# Altium schematic sheet OvertheTOP.SchDoc: OvertheTOP Sensor Board
size Tabloid; CompanyName: afasfe; Organization: Electric Ray Engineering; Address1: asdf; Address2: http://torpediniformes.com/; Address3: asdf; Address4: asdf; Revision: A1
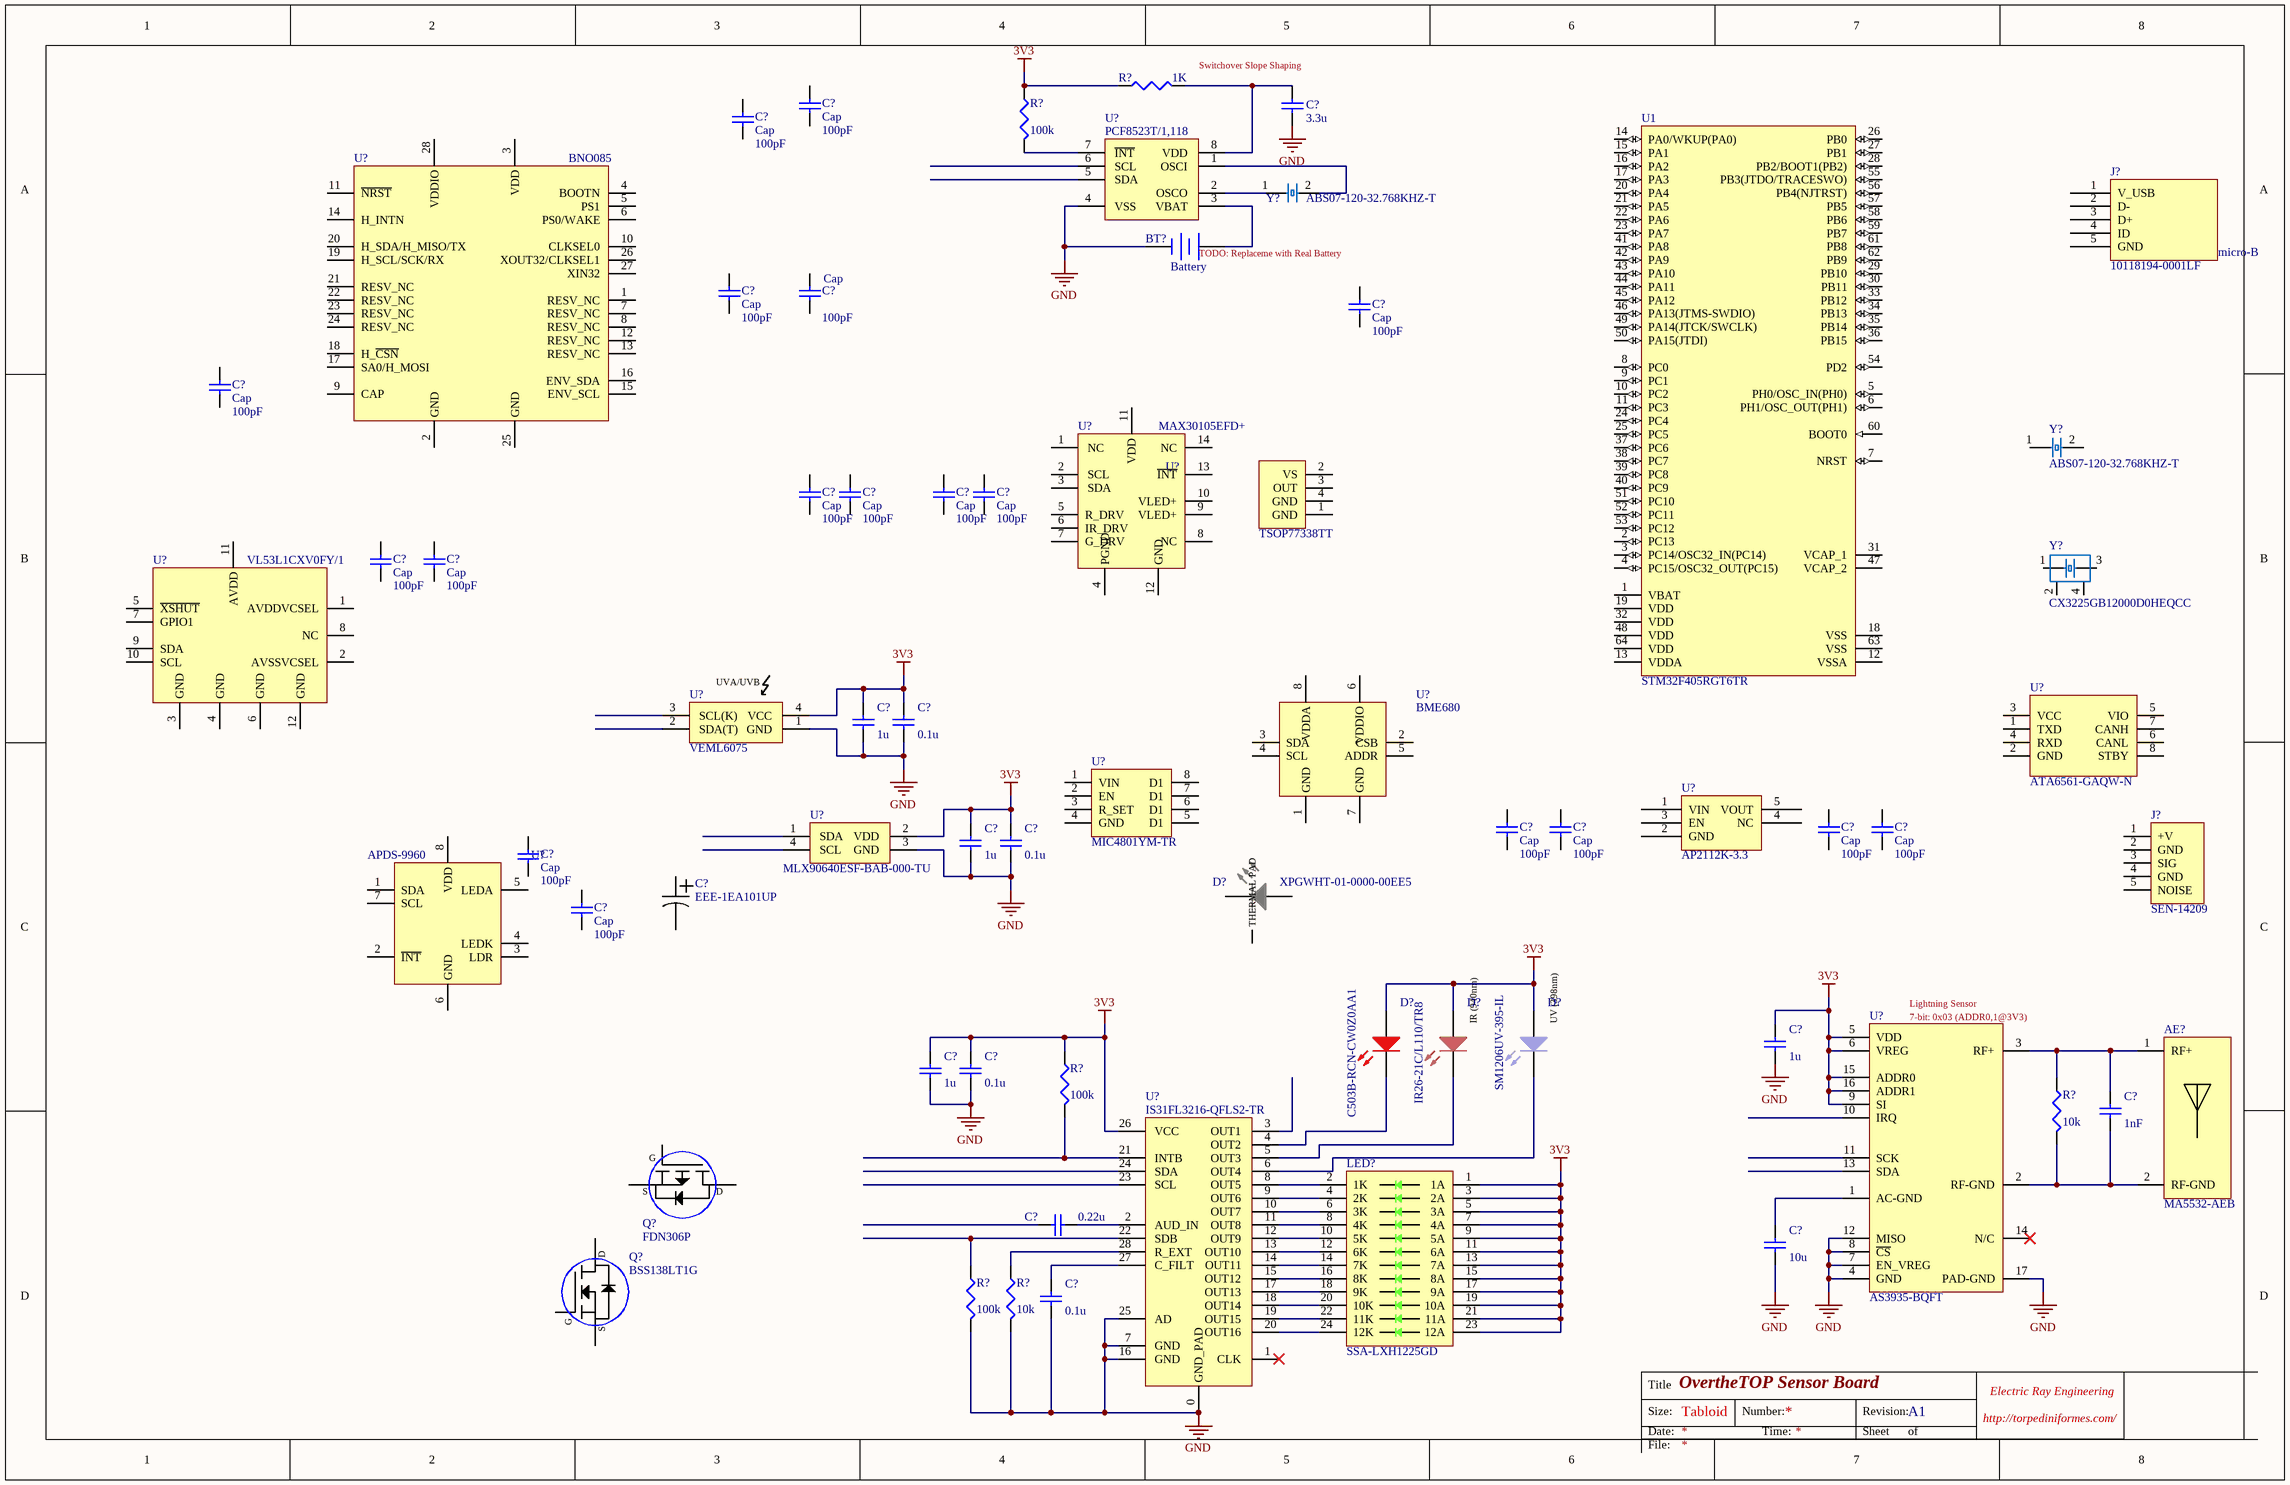
[diagram p0: OvertheTOP.SchDoc]

## Parts
(Parts that share a designator on the sheet are numbered #1, #2 ... from top to bottom, then left to right.)
AE?  MA5532-AEB  [MA5532]
BT?  Battery  [BAT-2]
C?#1  Cap  value 100pF  [6-0805_L]
C?#2  Cap  value 100pF  [6-0805_L]
C?#3  value 3.3u  [6-0805_L]  (hidden comment: Cap)
C?#4  Cap  value 100pF  [6-0805_L]
C?#5  Cap  value 100pF  [6-0805_L]
C?#6  Cap  value 100pF  [6-0805_L]
C?#7  Cap  value 100pF  [6-0805_L]
C?#8  Cap  value 100pF  [6-0805_L]
C?#9  Cap  value 100pF  [6-0805_L]
C?#10  Cap  value 100pF  [6-0805_L]
C?#11  Cap  value 100pF  [6-0805_L]
C?#12  Cap  value 100pF  [6-0805_L]
C?#13  Cap  value 100pF  [6-0805_L]
C?#14  value 1u  [6-0805_L]  (hidden comment: Cap)
C?#15  value 0.1u  [6-0805_L]  (hidden comment: Cap)
C?#16  Cap  value 100pF  [6-0805_L]
C?#17  Cap  value 100pF  [6-0805_L]
C?#18  Cap  value 100pF  [6-0805_L]
C?#19  Cap  value 100pF  [6-0805_L]
C?#20  value 1u  [6-0805_L]  (hidden comment: Cap)
C?#21  value 0.1u  [6-0805_L]  (hidden comment: Cap)
C?#22  Cap  value 100pF  [6-0805_L]
C?#23  EEE-1EA101UP  [CAP_SIZE_E_PANA]
C?#24  Cap  value 100pF  [6-0805_L]
C?#25  value 1u  [6-0805_L]  (hidden comment: Cap)
C?#26  value 1u  [6-0805_L]  (hidden comment: Cap)
C?#27  value 0.1u  [6-0805_L]  (hidden comment: Cap)
C?#28  value 1nF  [0603]  (hidden comment: Cap)
C?#29  value 0.22u  [6-0805_L]  (hidden comment: Cap)
C?#30  value 10u  [6-0805_L]  (hidden comment: Cap)
C?#31  value 0.1u  [6-0805_L]  (hidden comment: Cap)
D?#1  XPGWHT-01-0000-00EE5  [XP-G_LED]
D?#2  C503B-RCN-CW0Z0AA1  [C503B-RCN]
D?#3  IR26-21C/L110/TR8  [IR26-21C/L110/TR8]
D?#4  SM1206UV-395-IL  [SM1206UV-395-IL]
J?#1  10118194-0001LF  [USB-R/A-10118194-0001LF]
J?#2  SEN-14209  [SEN-14209]
LED?  SSA-LXH1225GD  [SSA-LXH1226GD]
Q?#1  FDN306P  [SuperSOT-3]
Q?#2  BSS138LT1G  [SOT-23]
R?#1  value 1K  [J1-0603]  (hidden comment: Res3)
R?#2  value 100k  [J1-0603]  (hidden comment: Res3)
R?#3  value 100k  [J1-0603]  (hidden comment: Res3)
R?#4  value 10k  [J1-0603]  (hidden comment: Res3)
R?#5  value 100k  [J1-0603]  (hidden comment: Res3)
R?#6  value 10k  [J1-0603]  (hidden comment: Res3)
U1  STM32F405RGT6TR  [STM-LQFP64_N]
U?#1  PCF8523T/1,118  [SO8]
U?#2  BNO085  [BNO085]
U?#3  TSOP77338TT  [TSOP77338TT]
U?#4  MAX30105EFD+  [OLGA-14_MAX30105]
U?#5  VL53L1CXV0FY/1  [VL53L1X]
U?#6  VEML6075  [VEML6075]
U?#7  ATA6561-GAQW-N  [ATA6561-GAQW-N]
U?#8  BME680  [BME680]
U?#9  MIC4801YM-TR  [SOIC8_MIC4801]
U?#10  AP2112K-3.3  [SOT25]
U?#11  MLX90640ESF-BAB-000-TU  [MLX90640]
U?#12  APDS-9960  [APDS-9960]
U?#13  AS3935-BQFT  [AS3935]
U?#14  IS31FL3216-QFLS2-TR  [QFN28_ISSI]
Y?#1  ABS07-120-32.768KHZ-T  [XTAL_32x15_BSB]
Y?#2  ABS07-120-32.768KHZ-T  [XTAL_32x15_BSB]
Y?#3  CX3225GB12000D0HEQCC  [XTAL32x25_BSB]

## Nets
3V3: C?#14.2 C?#15.2 C?#20.2 C?#21.2 C?#25.2 C?#26.2 C?#27.2 D?#2.1(A) D?#3.2(A) D?#4.1(A) LED?.1(1A) LED?.3(2A) LED?.5(3A) LED?.7(4A) LED?.9(5A) LED?.11(6A) LED?.13(7A) LED?.15(8A) LED?.17(9A) LED?.19(10A) LED?.21(11A) LED?.23(12A) R?#1.1 R?#2.1 R?#3.1 U?#6.4(VCC) U?#11.2(VDD) U?#13.5(VDD) U?#13.6(VREG) U?#13.9(SI) U?#13.15(ADDR0) U?#13.16(ADDR1) U?#14.26(VCC)
GND: BT?.2(-) C?#3.1 C?#14.1 C?#15.1 C?#20.1 C?#21.1 C?#25.1 C?#26.1 C?#27.1 C?#30.1 C?#31.1 R?#5.2 R?#6.2 U?#1.4(VSS) U?#6.1(GND) U?#11.3(GND) U?#13.4(GND) U?#13.7(EN_VREG) U?#13.8(~{CS}) U?#13.12(MISO) U?#13.17(PAD-GND) U?#14.0(GND_PAD) U?#14.7(GND) U?#14.16(GND) U?#14.25(AD)
NetAE?_1: AE?.1(RF+) C?#28.1 R?#4.1 U?#13.3(RF+)
NetAE?_2: AE?.2(RF-GND) C?#28.2 R?#4.2 U?#13.2(RF-GND)
NetBT?_1: BT?.1(+) U?#1.3(VBAT)
NetC?#3_2: C?#3.2 R?#1.2 U?#1.8(VDD)
NetC?#29_2: C?#29.2 U?#14.2(AUD_IN)
NetC?#30_2: C?#30.2 U?#13.1(AC-GND)
NetC?#31_2: C?#31.2 U?#14.27(C_FILT)
NetD?#2_2: D?#2.2(K) U?#14.4(OUT2)
NetD?#3_1: D?#3.1(K) U?#14.5(OUT3)
NetD?#4_2: D?#4.2(K) U?#14.6(OUT4)
NetLED?_2: LED?.2(1K) U?#14.8(OUT5)
NetLED?_4: LED?.4(2K) U?#14.9(OUT6)
NetLED?_6: LED?.6(3K) U?#14.10(OUT7)
NetLED?_8: LED?.8(4K) U?#14.11(OUT8)
NetLED?_10: LED?.10(5K) U?#14.12(OUT9)
NetLED?_12: LED?.12(6K) U?#14.13(OUT10)
NetLED?_14: LED?.14(7K) U?#14.14(OUT11)
NetLED?_16: LED?.16(8K) U?#14.15(OUT12)
NetLED?_18: LED?.18(9K) U?#14.17(OUT13)
NetLED?_20: LED?.20(10K) U?#14.18(OUT14)
NetLED?_22: LED?.22(11K) U?#14.19(OUT15)
NetLED?_24: LED?.24(12K) U?#14.20(OUT16)
NetR?#2_2: R?#2.2 U?#1.7(~{INT})
NetR?#3_2: R?#3.2 U?#14.21(INTB)
NetR?#5_1: R?#5.1 U?#14.22(SDB)
NetR?#6_1: R?#6.1 U?#14.28(R_EXT)
NetU?#1_1: U?#1.1(OSCI) Y?#1.2
NetU?#1_2: U?#1.2(OSCO) Y?#1.1

Not connected (* = marked no-connect by the designer): C?#1 1 2; C?#2 1 2; C?#4 1 2; C?#5 1 2; C?#6 1 2; C?#7 1 2; C?#8 1 2; C?#9 1 2; C?#10 1 2; C?#11 1 2; C?#12 1 2; C?#13 1 2; C?#16 1 2; C?#17 1 2; C?#18 1 2; C?#19 1 2; C?#22 1 2; C?#23 N P; C?#24 1 2; C?#29 1; D?#1 1(A) 2(K) 3(THERMAL_PAD); J?#1 1(V_USB) 2(D-) 3(D+) 4(ID) 5(GND); J?#2 1(+V) 2(GND) 3(SIG) 4(GND) 5(NOISE); Q?#1 1(G) 2(S) 3(D); Q?#2 1(G) 2(S) 3(D); U1 1(VBAT) 2(PC13) 3(PC14/OSC32_IN(PC14)) 4(PC15/OSC32_OUT(PC15)) 5(PH0/OSC_IN(PH0)) 6(PH1/OSC_OUT(PH1)) 7(NRST) 8(PC0) 9(PC1) 10(PC2) 11(PC3) 12(VSSA) 13(VDDA) 14(PA0/WKUP(PA0)) 15(PA1) 16(PA2) 17(PA3) 18(VSS) 19(VDD) 20(PA4) 21(PA5) 22(PA6) 23(PA7) 24(PC4) 25(PC5) 26(PB0) 27(PB1) 28(PB2/BOOT1(PB2)) 29(PB10) 30(PB11) 31(VCAP_1) 32(VDD) 33(PB12) 34(PB13) 35(PB14) 36(PB15) 37(PC6) 38(PC7) 39(PC8) 40(PC9) 41(PA8) 42(PA9) 43(PA10) 44(PA11) 45(PA12) 46(PA13(JTMS-SWDIO)) 47(VCAP_2) 48(VDD) 49(PA14(JTCK/SWCLK)) 50(PA15(JTDI)) 51(PC10) 52(PC11) 53(PC12) 54(PD2) 55(PB3(JTDO/TRACESWO)) 56(PB4(NJTRST)) 57(PB5) 58(PB6) 59(PB7) 60(BOOT0) 61(PB8) 62(PB9) 63(VSS) 64(VDD); U?#1 5(SDA) 6(SCL); U?#2 1(RESV_NC) 2(GND) 3(VDD) 4(BOOTN) 5(PS1) 6(PS0/WAKE) 7(RESV_NC) 8(RESV_NC) 9(CAP) 10(CLKSEL0) 11(~{NRST}) 12(RESV_NC) 13(RESV_NC) 14(H_INTN) 15(ENV_SCL) 16(ENV_SDA) 17(SA0/H_MOSI) 18(H_~{CSN}) 19(H_SCL/SCK/RX) 20(H_SDA/H_MISO/TX) 21(RESV_NC) 22(RESV_NC) 23(RESV_NC) 24(RESV_NC) 25(GND) 26(XOUT32/CLKSEL1) 27(XIN32) 28(VDDIO); U?#3 1(GND) 2(VS) 3(OUT) 4(GND); U?#4 1(NC) 2(SCL) 3(SDA) 4(PGND) 5(R_DRV) 6(IR_DRV) 7(G_DRV) 8(NC) 9(VLED+) 10(VLED+) 11(VDD) 12(GND) 13(~{INT}) 14(NC); U?#5 1(AVDDVCSEL) 2(AVSSVCSEL) 3(GND) 4(GND) 5(~{XSHUT}) 6(GND) 7(GPIO1) 8(NC) 9(SDA) 10(SCL) 11(AVDD) 12(GND); U?#6 2(SDA(T)) 3(SCL(K)); U?#7 1(TXD) 2(GND) 3(VCC) 4(RXD) 5(VIO) 6(CANL) 7(CANH) 8(STBY); U?#8 1(GND) 2(CSB) 3(SDA) 4(SCL) 5(ADDR) 6(VDDIO) 7(GND) 8(VDDA); U?#9 1(VIN) 2(EN) 3(R_SET) 4(GND) 5(D1) 6(D1) 7(D1) 8(D1); U?#10 1(VIN) 2(GND) 3(EN) 4(NC) 5(VOUT); U?#11 1(SDA) 4(SCL); U?#12 1(SDA) 2(~{INT}) 3(LDR) 4(LEDK) 5(LEDA) 6(GND) 7(SCL) 8(VDD); U?#13 10(IRQ) 11(SCK) 13(SDA) 14(N/C)*; U?#14 1(CLK)* 3(OUT1) 23(SCL) 24(SDA); Y?#2 1 2; Y?#3 1 2 3 4

## Notes on the sheet
- Switchover Slope Shaping
- (near BT?) TODO: Replaceme with Real Battery
- (near U?#13) Lightning Sensor
- (near U?#13) 7-bit: 0x03 (ADDR0,1@3V3)
- Title
- Size:
- Date:
- Tabloid
- Number:
- Time:
- Revision:
- Sheet
- of
- File:
- (in symbol 10118194-0001LF) micro-B
- (in symbol IR26-21C/L110/TR8) IR (940nm)
- (in symbol SM1206UV-395-IL) UV (398nm)
- (in symbol VEML6075) UVA/UVB

## Library data of the parts
AE? = MA5532-AE: RFID Transponders; Manufacturer: Coilcraft; Manufacturer Part Number: MA5532-AEB
BT? = Battery: Multicell Battery; Published: 24-Mar-1999; LatestRevisionDate: 17-Jul-2002; LatestRevisionNote: Re-released for DXP Platform.; PackageReference: BAT-2; Publisher: Altium Limited; PackageDescription: Battery; 2 Leads
C?#1-C?#22 C?#24-C?#31 = Cap: Capacitor; Published: 8-Jun-2000; LatestRevisionDate: 17-Jul-2002; LatestRevisionNote: Re-released for DXP Platform.; PackageReference: RAD-0.3; Publisher: Altium Limited; PackageDescription: Radial Cap, Thru-Hole; 2 Leads; 0.3 in Pin Spacing
C?#23 = EEE-1EA101UP: CAP ALUM 100UF 20% 25V SMD; Manufacturer: Panasonic Electronic Components; Manufacturer Part Number: EEE-1EA101UP
D?#1 = CREE_wLENS_XP-G_1: LED XLAMP NEUTRAL WHT 4000K 2SMD; Manufacturer: Cree Inc.; Manufacturer Part Number: XPGWHT-01-0000-00EE5
D?#2 = C503B-RCN-CW0Z0AA1: LED RED CLEAR 5MM ROUND T/H; Manufacturer: Cree Inc.; Manufacturer Part Number: C503B-RCN-CW0Z0AA1
D?#3 = IR26-21C/L110/TR8: EMITTER IR 940NM 65MA 1206; Manufacturer: Everlight Electronics Co Ltd; Manufacturer Part Number: IR26-21C/L110/TR8
D?#4 = SM1206UV-395-IL: EMITTER UV 398NM 25MA 1206; Manufacturer: Bivar Inc.; Manufacturer Part Number: SM1206UV-395-IL
J?#1 = 10118194-0001LF: USB uB R/A Board Edge Connector; Manufacturer: Amphenol FCI; Manufacturer Part Number: 10118194-0001LF
J?#2 = SEN-14209: Pocket Geiger Radiation Sensor - Type 5; Manufacturer: Sparkfun; Manufacturer Part Number: SEN-14209
LED? = SSA-LXH1225GD: LED ARRAY 2.5X5MM 12-SEG GREEN; Manufacturer: Lumex Opto/Components Inc.; Manufacturer Part Number: SSA-LXH1225GD
Q?#1 = FDN306P: P-Channel -1.8V Specified PowerTrench MOSFET; Manufacturer: On Semiconductor / Fairchild; Manufacturer Part Number: FDN306P
Q?#2 = BSS138LT1G: Power MOSFET, 200mA, 50V, N-Channel, SOT-23; Manufacturer: On Semiconductor; Manufacturer Part Number: BSS138LT1G
R?#1-R?#6 = Res3: Resistor; Published: 8-Jun-2000; LatestRevisionDate: 29-May-2009; LatestRevisionNote: IPC-7351 Footprint Added.; PackageReference: J1-0603; Publisher: Altium Limited; PackageDescription: Chip Resistor
U1 = CMP-0243-00156-1: ARM Cortex-M4 32-bit MCU+FPU, 1024 KB Flash, 192 KB Internal RAM, 51 I/Os, 64-Pin LQFP, -40 to 85 degC, Tape and Reel; Internal RAM Size (kB): 192; FLASH Size (Prog) (kB): 1024; Supply Voltage(Vcc) min (V): 1.8; D/A Converter: 2; Operating Frequency(F) (Processor speed) (MHz): 168; I/Os (High Current): 51; DatasheetVersion: Rev. 6; Package Description: LQFP64; ComponentLink2Description: Datasheet; ComponentLink1Description: Manufacturer URL; Packing: Tape and Reel; Mounting Technology: Surface Mount; Package Reference: 64-Pin Low-profile Quad Flat Package, Body 10 x 10 mm, Pitch 0.5 mm; ComponentLink2URL: http://www.st.com/st-web-ui/static/active/en/resource/technical/document/datasheet/DM00037051.pdf; ComponentLink1URL: http://www.st.com/; Core: ARM Cortex-M4; Supplier 1: Digi-Key; Supplier Part Number 1: 497-17432-1-ND
U?#1 = PCF8523: IC RTC CLK/CALENDAR I2C 8-SOIC; Manufacturer: NXP USA Inc.; Manufacturer Part Number: PCF8523T/1,118
U?#2 = BNO085: IMU ACCEL/GYRO/MAG I2C 32BIT; Manufacturer: Hillcrest Laboratories, Inc.; Manufacturer Part Number: BNO085
U?#3 = TSOP77338TT: MOD IR RCVR 38KHZ TOP VIEW; Manufacturer: Vishay Semiconductor Opto Division; Manufacturer Part Number: TSOP77338TT
U?#4 = MAX30105: SENSOR OPTIC AIR QUAL 14-OESIP; Manufacturer: Maxim Integrated; Manufacturer Part Number: MAX30105EFD+
U?#5 = VL53L1X: OPTICAL LGA12 4.9X2; Manufacturer: STMicroelectronics; Manufacturer Part Number: VL53L1CXV0FY/1
U?#6 = VEML6075: UVA/UVB SENSOR W/I2C 4-OPLGA; Manufacturer: Vishay Semiconductor Opto Division; Manufacturer Part Number: VEML6075
U?#7 = ATA6561: IC CAN TXVR INDUSTRIAL GRADE; Manufacturer: Microchip Technology; Manufacturer Part Number: ATA6561-GAQW-N
U?#8 = BME680: SENSOR RH PRESSURE TEMP VOC; Manufacturer: Bosch Sensortec; Manufacturer Part Number: BME680
U?#9 = MIC4801: IC LED DRVR LIN DIM 600MA 8SOIC; Manufacturer: Microchip Technology; Manufacturer Part Number: MIC4801YM-TR
U?#10 = AP2112K-3.3: IC REG LINEAR 3.3V 600MA SOT25; Manufacturer: Diodes Incorporated; Manufacturer Part Number: AP2112K-3.3
U?#11 = MLX90640: SENSOR DGTL -40C-85C TO39; Manufacturer: Melexis Technologies NV; Manufacturer Part Number: MLX90640ESF-BAB-000-TU
U?#12 = APDS-9960: SENSOR AMBIENT/PROX DGTL; Manufacturer: Broadcom Limited; Manufacturer Part Number: APDS-9960
U?#13 = AS3935: IC SENSOR LIGHTNING MLPQ-16; Manufacturer: ams; Manufacturer Part Number: AS3935-BQFT
U?#14 = IS31FL3216: IC LED DRIVER LIN DIM 20MA 28QFN; Manufacturer: ISSI, Integrated Silicon Solution Inc; Manufacturer Part Number: IS31FL3216-QFLS2-TR
Y?#1 Y?#2 = ABS07-120-32.768KHZ-T: CRYSTAL 32.7680KHZ 6PF SMD; Manufacturer: Abracon LLC; Manufacturer Part Number: ABS07-120-32.768KHZ-T
Y?#3 = CX3225GB12000D0HEQCC: CRYSTAL 12.0000MHZ 8PF SMD; Manufacturer: AVX / Kyocera; Manufacturer Part Number: CX3225GB12000D0HEQCC